# Altium schematic sheet TCA9548A I2C Multiplexer.SchDoc
size Letter
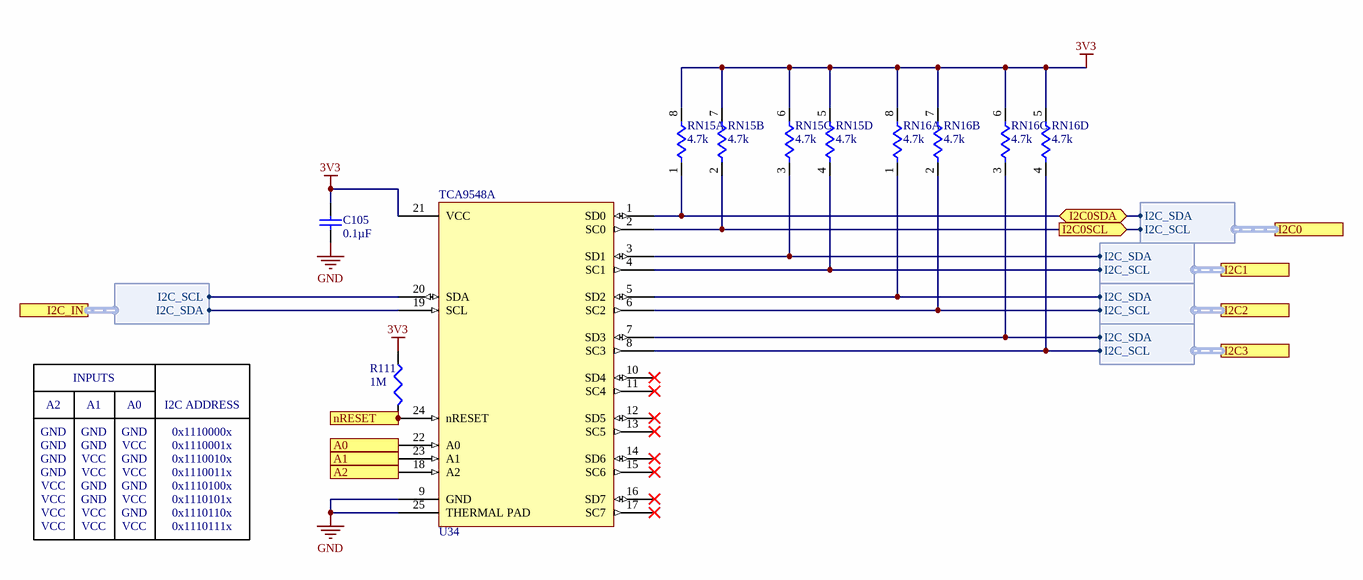
[diagram p0: TCA9548A I2C Multiplexer.SchDoc]

## Parts
C105  value 0.1µF  [TDK-CGA2B]  (hidden comment: Cap)
R111  value 1M  [PANA-ERJ2R]  (hidden comment: Res3)
RN15  value 4.7k  [PANA-EXB28V]  (hidden comment: Res4 Pack1)  (parts A,B,C,D of 4)
RN16  value 4.7k  [PANA-EXB28V]  (hidden comment: Res4 Pack1)  (parts A,B,C,D of 4)
U34  TCA9548A  [TI-RGE0024H]

## Ports
A0 (in), A1 (in), A2 (in), I2C0 (harness TCA9548A_I2C0), I2C0SCL (out), I2C0SDA (bidir), I2C1 (harness TCA9548A_I2C1), I2C2 (harness TCA9548A_I2C2), I2C3 (harness TCA9548A_I2C3), I2C_IN (harness TCA9548A_I2CIN), nRESET (in)

## Harnesses
TCA9548A_I2C1: I2C_SCL, I2C_SDA
TCA9548A_I2C2: I2C_SCL, I2C_SDA
TCA9548A_I2C3: I2C_SCL, I2C_SDA
TCA9548A_I2CIN: I2C_SCL, I2C_SDA
TCA9548A_I2C0: I2C_SCL, I2C_SDA

## Nets
3V3: C105.1 R111.2 RN15.5 RN15.6 RN15.7 RN15.8 RN16.5 RN16.6 RN16.7 RN16.8 U34.21(VCC)
GND: C105.2 U34.9(GND) U34.25(THERMAL_PAD)
A0: U34.22(A0) ; port A0
A1: U34.23(A1) ; port A1
A2: U34.18(A2) ; port A2
I2C0SCL: RN15.2 U34.2(SC0) ; port I2C0SCL, port I2C0.I2C_SCL
I2C0SDA: RN15.1 U34.1(SD0) ; port I2C0SDA, port I2C0.I2C_SDA
nRESET: R111.1 U34.24(nRESET) ; port nRESET
NetRN15_3: RN15.3 U34.3(SD1) ; port I2C1.I2C_SDA
NetRN15_4: RN15.4 U34.4(SC1) ; port I2C1.I2C_SCL
NetRN16_1: RN16.1 U34.5(SD2) ; port I2C2.I2C_SDA
NetRN16_2: RN16.2 U34.6(SC2) ; port I2C2.I2C_SCL
NetRN16_3: RN16.3 U34.7(SD3) ; port I2C3.I2C_SDA
NetRN16_4: RN16.4 U34.8(SC3) ; port I2C3.I2C_SCL
NetU34_19: U34.19(SCL) ; port I2C_IN.I2C_SDA
NetU34_20: U34.20(SDA) ; port I2C_IN.I2C_SCL

Not connected (* = marked no-connect by the designer): U34 10(SD4)* 11(SC4)* 12(SD5)* 13(SC5)* 14(SD6)* 15(SC6)* 16(SD7)* 17(SC7)*

## Notes on the sheet
- A2
- INPUTS
- A1
- A0
- I2C ADDRESS
- GND
- VCC
- 0x1110000x
- 0x1110001x
- 0x1110010x
- 0x1110011x
- 0x1110100x
- 0x1110101x
- 0x1110110x
- 0x1110111x
- (the "License"); you may not use or redistribute this file except in compliance with the License. You
- This file and the information within it are licensed under the terms of the Apache License, Version 2.0
- Copyright
- Unless required by applicable law or agreed to in writing, content distributed under the License is
- distributed on an "AS IS" BASIS, WITHOUT WARRANTIES OR CONDITIONS OF ANY KIND,
- either express or implied. See the License for the specific language governing permissions and
- limitations under the License.
- may obtain a copy of the License at:
- http://www.apache.org/licenses/LICENSE-2.0
- Title
- Size:
- Date:
- Letter
- Number:
- Time:
- Revision:
- Sheet
- of
- University of Alberta
- Deptartment of Electrical
- and Computer Engineering
- Edmonton AB, Canada
- T6G 1H9
- File:

## Library data of the parts
C105 = PC-TDK-02259: CAP CER 0.1UF 50V X7R 0402; Manufacturer Part Number: CGA2B3X7R1H104K050BB; Index: 2259; Designator: C?; Tolerance: ±10%; Published: 2016-03-16; LatestRevisionDate: 2016-03-16; LatestRevisionNote: ...; PackageReference: 0402 (1005 Metric); Publisher: AlbertaSat; PackageDescription: Radial Cap, Thru-Hole; 2 Leads; 0.3 in Pin Spacing; Part Number: PC-TDK-02259; Supplier Part Number 1: 445-6899-1-ND; Supplier 1: Digi-key; Supplier Link: http://www.digikey.ca/product-search/en?keywords=445-6899-1-ND; Voltage - Rated: 50V; Temperature Coefficient: X7R; Applications: Automotive; Operating Temperature: -55°C ~ 125°C
R111 = 19704: RES SMD 1M OHM 1% 1/10W 0402; Part Number: 19704; Manufacturer Part Number: ERJ-2RKF1004X; Designator: R?; Power: 0.1W, 1/10W; Temperature Coefficient: ±100ppm/°C; Published: 8-Jun-2000; LatestRevisionDate: 29-May-2009; LatestRevisionNote: IPC-7351 Footprint Added.; PackageReference: 0402 (1005 Metric); Publisher: Altium Limited; PackageDescription: Chip Resistor, 2-Leads, Body 1.00x0.50mm, IPC Low Density; Supplier Part Number 1: P1.00MLCT-ND; Supplier 1: Digi-Key; Supplier Link: http://www.digikey.ca/product-search/en?keywords=P1.00MLCT-ND; Tolerance: ±1%; Operating Temperature: -55°C ~ 155°C
RN15 RN16 = 19961: RES ARRAY 4 RES 4.7K OHM 0804; Part Number: 19961; Manufacturer Part Number: EXB-28V472JX; Sim Note: Enter the Resistance value into parameter field.; Designator: RN?; Tolerance: ±5%; Power: 62.5mW; Temperature Coefficient: ±200ppm/°C; Code_JEDEC: MS-012-AC; Supplier Part Number 1: Y7472CT-ND; Supplier 1: Digi-Key; Supplier Link: http://www.digikey.ca/product-search/en?keywords=Y7472CT-ND; PackageReference: 0804, Convex, Long Side Terminals
U34 = 159: IC BUS SWITCH 1 X 8:1 24VQFN; Part Number: 159; Designator: U?; Supplier Part Number 2: 595-TCA9548ARGERQ1; Supplier 2: Mouser; Manufacturer Part Number: TCA9548ARGERQ1; Supplier Part Number 1: 296-TCA9548ARGERQ1CT-ND; Supplier 1: Digi-Key; Supplier Link: #https://www.digikey.ca/en/products/detail/texas-instruments/TCA9548ARGERQ1/10434845#; PackageReference: 24-VFQFN Exposed Pad; Operating Temperature: -40°C ~ 85°C (TA)